# EAGLE design os22_diy (EAGLE 7.1.0)
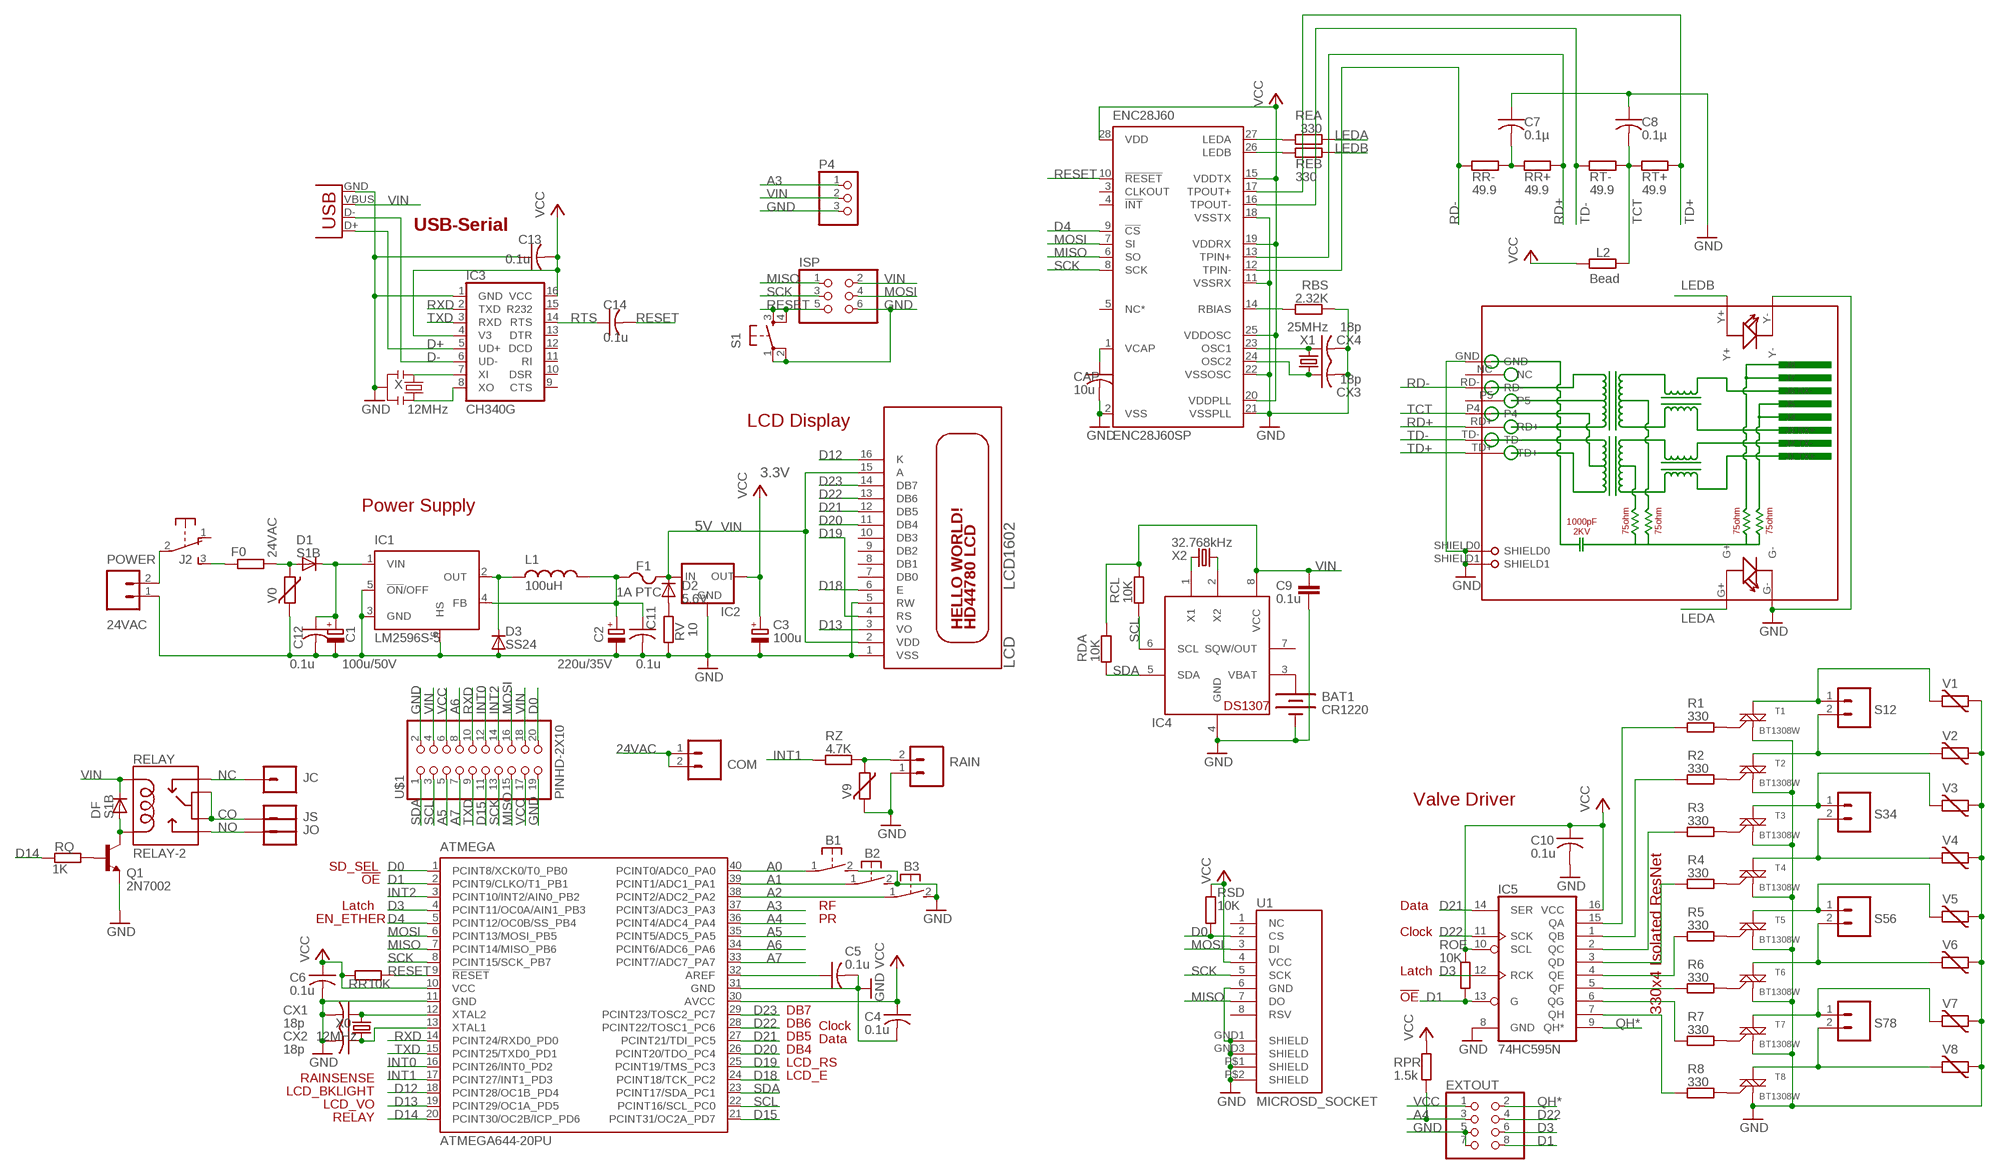
[diagram p0: schematic, sheet 1]

## Parts
ATMEGA  ATMEGA644-20PU  [DIL40]
B1  31-XX  [B3F-31XX]
B2  31-XX  [B3F-31XX]
B3  31-XX  [B3F-31XX]
BAT1  CR1220  BATTERYBATTERY_12MM_SMT  [BATTCON_12MM_SMT]
C1  100u/50V  CPOL-EUE3.5-8  [E3,5-8]
C2  220u/35V  CPOL-EUE3.5-8  [E3,5-8]
C3  100u  CPOL-EUE2-5  [E2-5]
C4  0.1u  C-USC0805K  [C0805K]
C5  0.1u  C-USC0805K  [C0805K]
C6  0.1u  C-USC0805K  [C0805K]
C7  0.1µ  C-USC0805K  [C0805K]
C8  0.1µ  C-USC0805K  [C0805K]
C9  0.1u  C-EUC0805  [C0805]
C10  0.1u  C-USC0805K  [C0805K]
C11  0.1u  C-USC0805K  [C0805K]
C12  0.1u  C-USC0805K  [C0805K]
C13  0.1u  C-USC0805K  [C0805K]
C14  0.1u  C-USC0805K  [C0805K]
CAP  10u  C-USC0805K  [C0805K]
COM  M025MM-X  [SCREWTERMINAL-5MM-2-X]
CX1  18p  C-USC0805K  [C0805K]
CX2  18p  C-USC0805K  [C0805K]
CX3  18p  C-USC0805K  [C0805K]
CX4  18p  C-USC0805K  [C0805K]
D1  S1B  DIODE-DO-214AC  [DO-214AC]
D2  5.6V  DIODE-MINIMELF  [MINIMELF]
D3  SS24  DIODE-SMB  [SMB]
DF  S1B  DIODE-DO-214AC  [DO-214AC]
ENC28J60  ENC28J60SP  [DIL28-3]
EXTOUT  PINHD-2X4  [2X04]
F0  R-EU_0411/3V  [0411V]
F1  1A PTC  PTCFUSE-1812  [1812]
IC1  LM2596S-5  LM2596S  [TO263-5]
IC2  MCP1700SOT233  [SOT23]
IC3  CH340G  [SO16]
IC4  DS1307  DS1307SOIC  [SO08]
IC5  74HC595N  74LS595D  [SO16]
ISP  PINHD-2X3  [2X03]
J2  EG1206  [EG1206]
JC  M01PTH  [1X01]
JO  M01PTH  [1X01]
JS  M01PTH  [1X01]
L1  100uH  INDUCTORPWR  [CDRH125]
L2  Bead  R-EU_R0805  [R0805]
LCD  LCD1602  HD44780LCDNOHOLE  [LCD1602A]
P4  PINHD-1X3  [1X03]
POWER  24VAC  M024MM-X  [SCREWTERMINAL-4MM-2-X]
Q1  2N7002  TRANSISTOR_NPNSOT23-3  [SOT23-3]
R1  330  R-EU_R0805  [R0805]
R2  330  R-EU_R0805  [R0805]
R3  330  R-EU_R0805  [R0805]
R4  330  R-EU_R0805  [R0805]
R5  330  R-EU_R0805  [R0805]
R6  330  R-EU_R0805  [R0805]
R7  330  R-EU_R0805  [R0805]
R8  330  R-EU_R0805  [R0805]
RAIN  M025MM-X  [SCREWTERMINAL-5MM-2-X]
RBS  2.32K  R-EU_R0805  [R0805]
RCL  10K  R-EU_R0805  [R0805]
RDA  10K  R-EU_R0805  [R0805]
REA  330  R-EU_R0805  [R0805]
REB  330  R-EU_R0805  [R0805]
RELAY  RELAY-2  [RELAY-HK4100F]
RJ45  HR911105A  [HR911105A]
ROE  10K  R-EU_R0805  [R0805]
RPR  1.5k  R-EU_R0805  [R0805]
RQ  1K  R-EU_R0805  [R0805]
RR  10K  R-EU_R0805  [R0805]
RR+  49.9  R-EU_R0805  [R0805]
RR-  49.9  R-EU_R0805  [R0805]
RSD  10K  R-EU_R0805  [R0805]
RT+  49.9  R-EU_R0805  [R0805]
RT-  49.9  R-EU_R0805  [R0805]
RV  10  R-EU_R0805  [R0805]
RZ  4.7K  R-EU_R0805  [R0805]
S1  TAC_SWITCHSMD  [TACTILE_SWITCH_SMD]
S12  M025MM-X  [SCREWTERMINAL-5MM-2-X]
S34  M025MM-X  [SCREWTERMINAL-5MM-2-X]
S56  M025MM-X  [SCREWTERMINAL-5MM-2-X]
S78  M025MM-X  [SCREWTERMINAL-5MM-2-X]
T1  BT1308W  MAC97  [TO-92]
T2  BT1308W  MAC97  [TO-92]
T3  BT1308W  MAC97  [TO-92]
T4  BT1308W  MAC97  [TO-92]
T5  BT1308W  MAC97  [TO-92]
T6  BT1308W  MAC97  [TO-92]
T7  BT1308W  MAC97  [TO-92]
T8  BT1308W  MAC97  [TO-92]
U1  MICROSD_SOCKET  USD-SOCKETMICRO-SD-SOCKET-TAOBAO  [MICRO-SD-SOCKET-TAOBAO]
U$1  PINHD-2X10  [2X10-CLEANBIG]
USB  USBPTH  [USB-B-PTH]
V0  MOV  VARISTOR-5  [R-5]
V1  MOV  VARISTOR-5  [R-5]
V2  MOV  VARISTOR-5  [R-5]
V3  MOV  VARISTOR-5  [R-5]
V4  MOV  VARISTOR-5  [R-5]
V5  MOV  VARISTOR-5  [R-5]
V6  MOV  VARISTOR-5  [R-5]
V7  MOV  VARISTOR-5  [R-5]
V8  MOV  VARISTOR-5  [R-5]
V9  MOV  VARISTOR-5  [R-5]
X  12MHz  RESONATORSMD  [RESONATOR-SMD]
X0  12MHz  CRYSTALHC49UV  [HC49U-V]
X1  25MHz  CRYSTALHC49UV  [HC49U-V]
X2  32.768kHz  CRYSTALTC38H  [TC38H]

## Nets
24VAC [power]: COM.1 COM.2 D1.A F0.2 V0.1
A0: ATMEGA.40(PCINT0/ADC0_PA0) B1.1(P)
A1: ATMEGA.39(PCINT1/ADC1_PA1) B2.1(P)
A2: ATMEGA.38(PCINT2/ADC2_PA2) B3.1(P)
A3: ATMEGA.37(PCINT3/ADC3_PA3) P4.1
A4: ATMEGA.36(PCINT4/ADC4_PA4) EXTOUT.3 RPR.1
A5: ATMEGA.35(PCINT5/ADC5_PA5) U$1.5
A6: ATMEGA.34(PCINT6/ADC6_PA6) U$1.8
A7: ATMEGA.33(PCINT7/ADC7_PA7) U$1.7
AREF: ATMEGA.32(AREF) C5.1
CO [relaypower]: JS.1 RELAY.5 RELAY.6
D0: ATMEGA.1(PCINT8/XCK0/T0_PB0) RSD.1 U1.2(CS) U$1.20
D1: ATMEGA.2(PCINT9/CLKO/T1_PB1) EXTOUT.8 IC5.13(G) ROE.1
D3: ATMEGA.4(PCINT11/OC0A/AIN1_PB3) EXTOUT.6 IC5.12(RCK)
D4: ATMEGA.5(PCINT12/OC0B/SS_PB4) ENC28J60.9(!CS)
D12: ATMEGA.18(PCINT28/OC1B_PD4) LCD.16(K)
D13: ATMEGA.19(PCINT29/OC1A_PD5) LCD.3(VO)
D14: ATMEGA.20(PCINT30/OC2B/ICP_PD6) RQ.2
D15: ATMEGA.21(PCINT31/OC2A_PD7) U$1.11
D18: ATMEGA.24(PCINT18/TCK_PC2) LCD.6(E)
D19: ATMEGA.25(PCINT19/TMS_PC3) LCD.4(RS)
D20: ATMEGA.26(PCINT20/TDO_PC4) LCD.11(DB4)
D21: ATMEGA.27(PCINT21/TDI_PC5) IC5.14(SER) LCD.12(DB5)
D22: ATMEGA.28(PCINT22/TOSC1_PC6) EXTOUT.4 IC5.11(SCK) LCD.13(DB6)
D23: ATMEGA.29(PCINT23/TOSC2_PC7) LCD.14(DB7)
D+: IC3.5(UD+) USB.D+
D-: IC3.6(UD-) USB.D-
GND [power]: ATMEGA.11(GND) ATMEGA.31(GND) B1.2(S) B2.2(S) B3.2(S) BAT1.P$1(-) C1.- C2.- C3.- C4.2 C5.2 C6.2 C7.1 C8.1 C9.2 C10.2 C11.2 C12.2 C13.1 CAP.2 CX1.2 CX2.2 CX3.2 CX4.2 D3.A ENC28J60.2(VSS) ENC28J60.11(VSSRX) ENC28J60.18(VSSTX) ENC28J60.21(VSSPLL) ENC28J60.22(VSSOSC) EXTOUT.5 EXTOUT.7 IC1.3(GND) IC1.5(!ON!/OFF) IC1.6(HS) IC2.1(GND) IC3.1(GND) IC4.4(GND) IC5.8(GND) ISP.6 LCD.1(VSS) LCD.5(RW) P4.3 POWER.1 Q1.2(E) RAIN.1 RBS.2 RJ45.G- RJ45.GND RJ45.SHIELD0 RJ45.SHIELD1 RJ45.Y- RV.2 S1.1 S1.2 T1.1(M1) T2.1(M1) T3.1(M1) T4.1(M1) T5.1(M1) T6.1(M1) T7.1(M1) T8.1(M1) U1.6(GND) U1.GND1(SHIELD) U1.GND3(SHIELD) U1.P$1(SHIELD) U1.P$2(SHIELD) U$1.2 U$1.19 USB.GND V0.2 V1.1 V2.1 V3.1 V4.1 V5.1 V6.1 V7.1 V8.1 V9.2 X.2
INT0: ATMEGA.16(PCINT26/INT0_PD2) U$1.12
INT1: ATMEGA.17(PCINT27/INT1_PD3) RZ.2
INT2: ATMEGA.3(PCINT10/INT2/AIN0_PB2) U$1.14
LEDA: REA.2 RJ45.G+
LEDB: REB.2 RJ45.Y+
MISO: ATMEGA.7(PCINT14/MISO_PB6) ENC28J60.6(SO) ISP.1 U1.7(DO) U$1.15
MOSI: ATMEGA.6(PCINT13/MOSI_PB5) ENC28J60.7(SI) ISP.4 U1.3(DI) U$1.16
N$1 [power]: C1.+ C12.1 D1.C IC1.1(VIN)
N$2 [power]: C2.+ C11.1 F1.1 IC1.4(FB) L1.2
N$3: R1.1 T1.2(G)
N$4: IC5.5(QF) R6.2
N$5: IC5.6(QG) R7.2
N$6 [power]: J2.2(P) POWER.2
N$7: IC5.7(QH) R8.2
N$8: BAT1.P$2(+) IC4.3(VBAT)
N$9 [power]: D3.C IC1.2(OUT) L1.1
N$10: IC5.4(QE) R5.2
N$11: IC5.3(QD) R4.2
N$12: IC5.2(QC) R3.2
N$13: IC5.1(QB) R2.2
N$14: IC5.15(QA) R1.2
N$15: R2.1 T2.2(G)
N$16 [power]: S12.1 T1.3(M2) V1.2
N$17 [power]: S12.2 T2.3(M2) V2.2
N$18 [power]: S34.1 T3.3(M2) V3.2
N$19: ENC28J60.14(RBIAS) RBS.1
N$20 [power]: S34.2 T4.3(M2) V4.2
N$21: R3.1 T3.2(G)
N$22 [power]: S56.1 T5.3(M2) V5.2
N$23 [power]: S56.2 T6.3(M2) V6.2
N$24 [power]: S78.1 T7.3(M2) V7.2
N$25 [power]: S78.2 T8.3(M2) V8.2
N$26: R4.1 T4.2(G)
N$27: R5.1 T5.2(G)
N$28: R6.1 T6.2(G)
N$29: R7.1 T7.2(G)
N$30: IC4.1(X1) X2.2
N$31: RAIN.2 RZ.1 V9.1
N$32 [power]: F0.1 J2.3(S)
N$33: CAP.1 ENC28J60.1(VCAP)
N$34: ENC28J60.27(LEDA) REA.1
N$35: DF.A Q1.3(C) RELAY.9
N$36: IC4.2(X2) X2.1
N$37: ENC28J60.26(LEDB) REB.1
N$39: D2.A RV.1
N$40: Q1.1(B) RQ.1
N$41: CX3.1 ENC28J60.24(OSC2) X1.2
N$42: CX4.1 ENC28J60.23(OSC1) X1.1
N$43: R8.1 T8.2(G)
N$44: IC3.7(XI) X.1
N$46: ATMEGA.12(XTAL2) CX1.1 X0.2
N$47: ATMEGA.13(XTAL1) CX2.1 X0.1
N$48: IC3.8(XO) X.3
N$54: C7.2 RR+.1 RR-.2
NC [relaypower]: JC.1 RELAY.1
NO [relaypower]: JO.1 RELAY.10
QH*: EXTOUT.2 IC5.9(QH*)
RD+: ENC28J60.13(TPIN+) RJ45.RD+ RR+.2
RD-: ENC28J60.12(TPIN-) RJ45.RD- RR-.1
RESET: ATMEGA.9(!RESET) C14.2 ENC28J60.10(!RESET) ISP.5 RR.2 S1.3 S1.4
RTS: C14.1 IC3.14(RTS)
RXD: ATMEGA.14(PCINT24/RXD0_PD0) IC3.2(TXD) U$1.10
SCK: ATMEGA.8(PCINT15/SCK_PB7) ENC28J60.8(SCK) ISP.3 U1.5(SCK) U$1.13
SCL: ATMEGA.22(PCINT16/SCL_PC0) IC4.6(SCL) RCL.2 U$1.3
SDA: ATMEGA.23(PCINT17/SDA_PC1) IC4.5(SDA) RDA.2 U$1.1
TCT: C8.2 L2.1 RJ45.P4 RT+.1 RT-.2
TD+: ENC28J60.17(TPOUT+) RJ45.TD+ RT+.2
TD-: ENC28J60.16(TPOUT-) RJ45.TD- RT-.1
TXD: ATMEGA.15(PCINT25/TXD0_PD1) IC3.3(RXD) U$1.9
VCC: ATMEGA.10(VCC) ATMEGA.30(AVCC) C3.+ C4.1 C6.1 C10.1 C13.2 ENC28J60.15(VDDTX) ENC28J60.19(VDDRX) ENC28J60.20(VDDPLL) ENC28J60.25(VDDOSC) ENC28J60.28(VDD) EXTOUT.1 IC2.2(OUT) IC3.4(V3) IC3.16(VCC) IC5.10(SCL) IC5.16(VCC) L2.2 ROE.2 RPR.2 RR.1 RSD.2 U1.4(VCC) U$1.6 U$1.17
VIN [power]: C9.1 D2.C DF.C F1.2 IC2.3(IN) IC4.8(VCC) ISP.2 LCD.2(VDD) LCD.15(A) P4.2 RCL.1 RDA.1 RELAY.2 U$1.4 U$1.18 USB.VBUS
Unconnected: ENC28J60.3(CLKOUT) ENC28J60.4(!INT) ENC28J60.5(NC*) IC3.9(CTS) IC3.10(DSR) IC3.11(RI) IC3.12(DCD) IC3.13(DTR) IC3.15(R232) IC4.7(SQW/OUT) J2.1(O) LCD.7(DB0) LCD.8(DB1) LCD.9(DB2) LCD.10(DB3) RJ45.NC RJ45.P5 U1.1(NC) U1.8(RSV)

## Notes on the sheet
- USB-Serial
- LCD Display
- 3.3V
- Power Supply
- 5V
- Valve Driver
- SD_SEL
- !OE
- Latch | RF | Data
- EN_ETHER | PR
- Clock
- Latch
- !OE
- DB7 | 330x4 Isolated ResNet
- Clock
- DB6
- Data
- DB5
- DB4
- LCD_RS
- RAINSENSE
- LCD_E
- LCD_BKLIGHT
- LCD_VO
- RELAY

## Library data of the parts
ATMEGA = atmel:ATMEGA644-*PU: 8-bit Microcontroller with 64K Bytes In-System Programmable Flash Auto generated by make-symbol-device-package-bsdl.ulp Rev. 34 Source: http://www.atmel.com/dyn/resources/prod_documents/doc2593.pdf; MPN: ATMEGA644-20PU; OC_FARNELL: 1288340; OC_NEWARK: 23M5060
B1-B3 = adafruit:31-XX: OMRON SWITCH Now with beefier pads!
BAT1 = SparkFunNew:BATTERY: Battery Holders Various common sizes : AA, AAA, 20mm coin cell and 12mm coin cell.
C1-C3 = resistor:CPOL-EU: POLARIZED CAPACITOR, European symbol
C4-C8 C10-C12 CAP CX1-CX4 = adafruit2013:C-US: CAPACITOR, American symbol
C9 = rcl:C-EU: CAPACITOR, European symbol
C13 C14 = adafruit:C-US: CAPACITOR, American symbol
COM POWER RAIN S12 S34 S56 S78 = SparkFun:M02: Header 2 Standard 2-pin 0.1" header. Use with straight break away headers (SKU : PRT-00116), right angle break away headers (PRT-00553), swiss pins (PRT-00743), machine pins (PRT-00117), and female headers (PRT-00115). Molex polarized connector foot print use with SKU : PRT-08233 with associated crimp pins and housings.
D1-D3 DF = diode:DIODE-: DIODE
ENC28J60 = microchip:ENC28J60: Stand-Alone Ethernet Controller with SPI Interface Source: http://ww1.microchip.com/downloads/en/DeviceDoc/39662c.pdf; MF: MICROCHIP; MPN: ENC28J60/SP; OC_FARNELL: 1084619; OC_NEWARK: 96K3661
EXTOUT = pinhead:PINHD-2X4: PIN HEADER
F0 L2 R1-R8 RBS RCL RDA REA REB ROE RPR RQ RR RR+ RR- RSD RT+ RT- RV RZ = rcl:R-EU_: RESISTOR, European symbol
F1 = adafruit:PTCFUSE: PTC fuses, resettable thermistors
IC1 = national-semiconductor:LM2596: SIMPLE SWITCHER® Power Converter 150 kHz 3A Step-Down Voltage Regulator Source: http://www.national.com/ds/LM/LM2596.pdf; MF: NATIONAL SEMICONDUCTOR; MPN: LM2596S-ADJ/NOPB; OC_FARNELL: 9494367; OC_NEWARK: 41K3842
IC2 = adafruit:MCP1700: VOLTAGE REGULATOR
IC3 = SparkFunNew:CH340
IC4 = adafruit:DS1307: DS1307 Real time clock (RTC) with battery backup ability. Talk to it via i2c
IC5 = SparkFun:74*595: 8-bit SHIFT REGISTER, output latch
ISP = pinhead:PINHD-2X3: PIN HEADER
J2 = adafruit:EG1206
JC JO JS = SparkFun:M01: Header 1 Standard 1-pin 0.1" header. Use with straight break away headers (SKU : PRT-00116), right angle break away headers (PRT-00553), swiss pins (PRT-00743), machine pins (PRT-00117), and female headers (PRT-00115).
L1 = SparkFunNew:INDUCTOR: Inductors Basic Inductor/Choke - 0603 and 1206. Footprints are not proven and vary greatly between part numbers.
LCD = adafruit:HD44780LCD: HD44780 LCD Standard character type LCDs, available in sizes from 8x1 to 40x4!
P4 = pinhead:PINHD-1X3: PIN HEADER
Q1 = SparkFunNew:TRANSISTOR_NPN: Transistor NPN BJT configuration in SOT23 package. MMBT2222 is the common NPN we use. Double check BCE configuration again layout.
RELAY = SparkFunNew:RELAY-2
RJ45 = CONNECTER:HR911105A
S1 = SparkFunNew:TAC_SWITCH: Momentary Switch Button commonly used for reset or general input. Spark Fun Electronics SKU : COM-00097
T1-T8 = SparkFun:MAC97: MAC97 Triac http://www.onsemi.com/pub_link/Collateral/MAC97-D.PDF
U1 = SparkFunNew:USD-SOCKET: microSD Socket Push-push type uSD socket. Schematic element and footprint production proven. Spark Fun Electronics SKU : PRT-00127. tDoc lines correctly indicate media card edge positions when inserting (unlocked, locked, depressed).
U$1 = adafruit:PINHD-2X10
USB = SparkFunNew:USB: USB Connectors USB-B-PTH is fully proven SKU : PRT-00139 USB-miniB is fully proven SKU : PRT-00587 USB-A-PCB is untested. USB-A-H is throughly reviewed, but untested. Spark Fun Electronics SKU : PRT-00437 USB-B-SMT is throughly reviewed, but untested. Needs silkscreen touching up. USB-A-S has not been used/tested USB-MB-H has not been used/tested
V0 V1-V9 = varistor:VARISTOR: VARISTOR
X = SparkFunNew:RESONATOR: Resonator Small SMD resonator. This is the itty bitty 10/20MHz resonators with built in caps. CSTCE10M0G55 and CSTCE20M0V53. Footprint has been reviewed closely but hasn't been tested yet.
X0 X1 = SparkFun:CRYSTAL: Crystals Various standard crystals. Proven footprints. Spark Fun Electronics SKU : COM-00534
X2 = crystal:CRYSTAL: CRYSTAL; OC_FARNELL: unknown; OC_NEWARK: unknown

## Net classes
0 default: width 0.203 mm, clearance 0.203 mm
1 power: width 0.305 mm, clearance 0.203 mm
2 relaypower: width 0.508 mm, clearance 0.305 mm

## Board
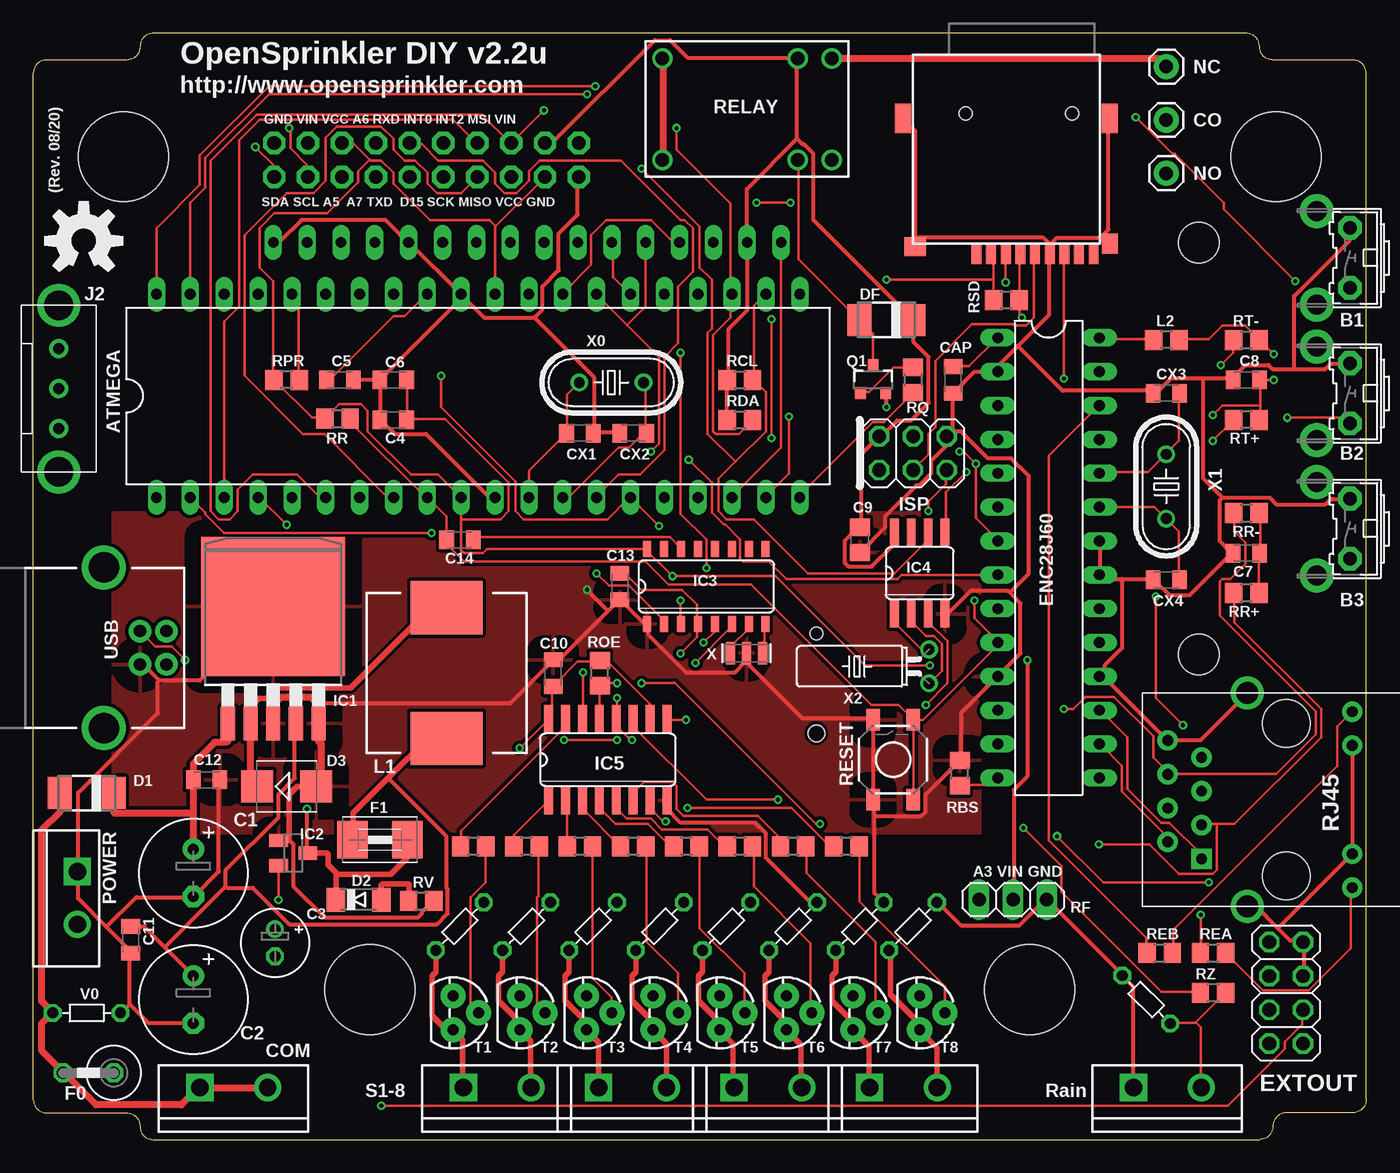
[diagram p1: board, top side]
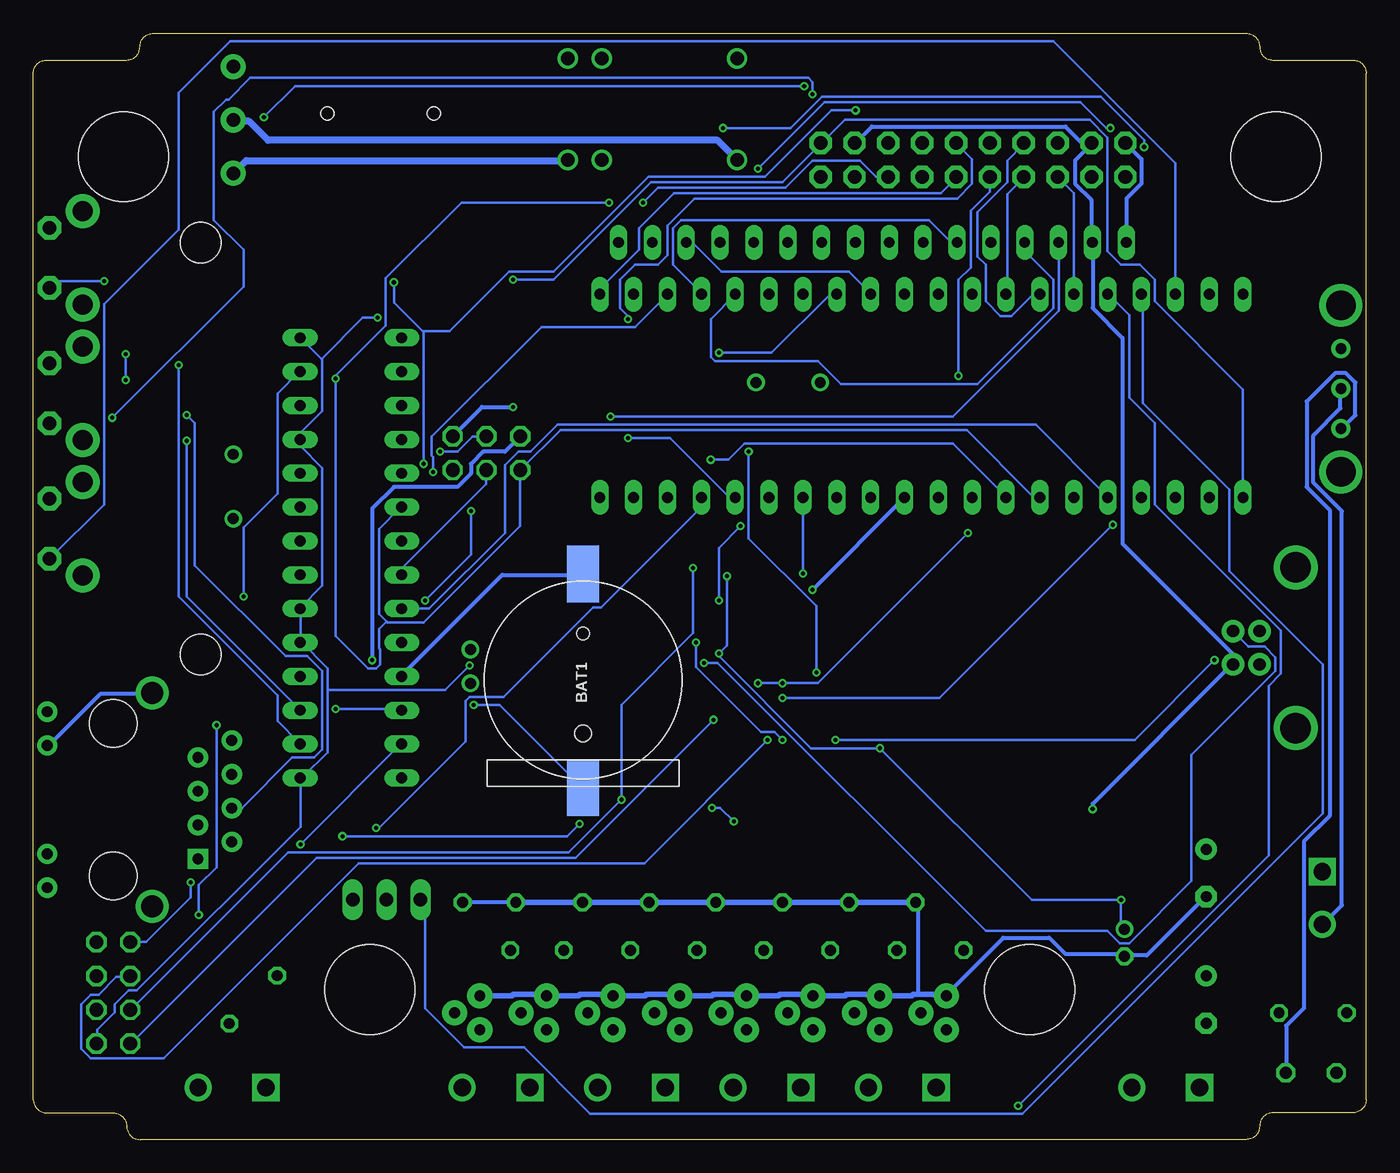
[diagram p2: board, bottom side, seen from below]

Size 100 x 83 mm. Coordinates in mm from the lower left corner, seen from the top.
Outline: 90,83 9,83 arc90 8,82 arc-90 7,81 1,81 arc90 0,80 0,3 arc90 1,2 7,2 arc-90 8,1 arc90 9,0 92,0 arc90 93,1 arc-90 94,2 99,2 arc90 100,3 100,80 arc90 99,81 93,81 arc-90 92,82 arc90 91,83 90,83
Copper layers (1*16): Top 0.035mm / dielectric 1.5mm / Bottom 0.035mm
Design rules "Fusion_eagle_rule_v1.1 *": minimum track width 6mil, minimum drill 12mil, track to track 6mil, track to pad 6mil, pad to pad 6mil, via to via 6mil, smd to smd 0mil, copper to edge 10mil, drill to drill 10mil, minimum pad ring 10mil, minimum via ring 6mil, stop-mask expansion 2mil, vias tented up to drill 100mil, thermal gap 50mil
Holes 3.05 mm at 87.46,67.3 87.46,36.38
Holes 6.75 mm at 6.76,73.74 93.24,73.74 25.26,11.26 74.74,11.26
tRestrict: area 84.4,31.3 to 90.5,37.4; area 84.4,62.2 to 90.5,68.3; area 2.8,67.7 to 10.8,75.7; area 89.2,67.7 to 97.2,75.7; area 21.3,5.3 to 29.3,13.3; area 70.7,5.3 to 78.7,13.3
bRestrict: area 2.8,67.7 to 10.8,75.7; area 89.2,67.7 to 97.2,75.7; area 21.3,5.3 to 29.3,13.3; area 70.7,5.3 to 78.7,13.3; area 84.4,62.2 to 90.5,68.3; area 84.4,31.3 to 90.5,37.4
vRestrict: area 70,19.5 to 77,20.5; area 17.3,76.2 to 39.3,76.9; area 17.1,70 to 42.6,70.7

### Footprints (pad centres in the part's own frame; a part is rotated, then mirrored left to right if it is on the bottom)
DIL40 = drill 0.813 long: 1 -24.13,-7.62; 2 -21.59,-7.62; 3 -19.05,-7.62; 4 -16.51,-7.62; 5 -13.97,-7.62; 6 -11.43,-7.62; 7 -8.89,-7.62; 8 -6.35,-7.62; 9 -3.81,-7.62; 10 -1.27,-7.62; 11 1.27,-7.62; 12 3.81,-7.62; 13 6.35,-7.62; 14 8.89,-7.62; 15 11.43,-7.62; 16 13.97,-7.62; 17 16.51,-7.62; 18 19.05,-7.62; 19 21.59,-7.62; 20 24.13,-7.62; 21 24.13,7.62; 22 21.59,7.62; 23 19.05,7.62; 24 16.51,7.62; 25 13.97,7.62; 26 11.43,7.62; 27 8.89,7.62; 28 6.35,7.62; 29 3.81,7.62; 30 1.27,7.62; 31 -1.27,7.62; 32 -3.81,7.62; 33 -6.35,7.62; 34 -8.89,7.62; 35 -11.43,7.62; 36 -13.97,7.62; 37 -16.51,7.62; 38 -19.05,7.62; 39 -21.59,7.62; 40 -24.13,7.62
B3F-31XX = drill 1.016 pad 1.778 octagon: 1 -2.261,-1.245; 2 2.261,-1.245 | drill 1.499 pad 2.54: 3 -3.505,1.245; 4 3.505,1.245
BATTCON_12MM_SMT = smd 2.4 x 4.3: P$1 0,11.96 | smd 2.4 x 4.2: P$2 0,-4.1 | hole 0.95: 0,7.5 | hole 1.25: 0,0
E3,5-8 = drill 0.813 pad 1.6: + -1.778,0 | drill 0.813 pad 1.6 octagon: - 1.778,0
E2-5 = drill 0.813 pad 1.27: + -1.016,0 | drill 0.813 pad 1.27 octagon: - 1.016,0
C0805K = smd 1.1 x 1.4: 1 -1,0; 2 1,0
C0805 = smd 1.3 x 1.5: 1 -0.95,0; 2 0.95,0
SCREWTERMINAL-5MM-2-X = drill 1.3 pad 2.032 square: 1 0,0 | drill 1.3 pad 2.032: 2 5.08,0
DO-214AC = smd 1.8 x 2.4: A 2.025,0; C -2.025,0
MINIMELF = smd 1.4 x 1.8: A 1.7,0; C -1.7,0
SMB = smd 2.4 x 2.4: A 2.2,0; C -2.2,0
DIL28-3 = drill 0.813 long: 1 -16.51,-3.81; 2 -13.97,-3.81; 3 -11.43,-3.81; 4 -8.89,-3.81; 5 -6.35,-3.81; 6 -3.81,-3.81; 7 -1.27,-3.81; 8 1.27,-3.81; 9 3.81,-3.81; 10 6.35,-3.81; 11 8.89,-3.81; 12 11.43,-3.81; 13 13.97,-3.81; 14 16.51,-3.81; 15 16.51,3.81; 16 13.97,3.81; 17 11.43,3.81; 18 8.89,3.81; 19 6.35,3.81; 20 3.81,3.81; 21 1.27,3.81; 22 -1.27,3.81; 23 -3.81,3.81; 24 -6.35,3.81; 25 -8.89,3.81; 26 -11.43,3.81; 27 -13.97,3.81; 28 -16.51,3.81
2X04 = drill 1.016 octagon: 1 -3.81,-1.27; 2 -3.81,1.27; 3 -1.27,-1.27; 4 -1.27,1.27; 5 1.27,-1.27; 6 1.27,1.27; 7 3.81,-1.27; 8 3.81,1.27
0411V = drill 0.914 octagon: 1 -2.54,0; 2 1.27,0
1812 = smd 2.286 x 2.794: 1 -2.046,0; 2 2.046,0
TO263-5 = smd 1.067 x 2.54: 1 -3.404,-5.791; 2 -1.702,-5.791; 3 0,-5.791; 4 1.702,-5.791; 5 3.404,-5.791 | smd 10.8 x 10.41: 6 0,3
SOT23 = smd 1 x 1.4: 1 -0.95,-1.1; 2 0.95,-1.1; 3 0,1.1
SO16 = smd 0.6 x 1.2: 1 -4.445,-2.8; 2 -3.175,-2.8; 3 -1.905,-2.8; 4 -0.635,-2.8; 5 0.635,-2.8; 6 1.905,-2.8; 7 3.175,-2.8; 8 4.445,-2.8; 9 4.445,2.8; 10 3.175,2.8; 11 1.905,2.8; 12 0.635,2.8; 13 -0.635,2.8; 14 -1.905,2.8; 15 -3.175,2.8; 16 -4.445,2.8
SO08 = smd 0.66 x 2.032: 1 -1.905,-3.073; 2 -0.635,-3.073; 3 0.635,-3.073; 4 1.905,-3.073; 5 1.905,3.073; 6 0.635,3.073; 7 -0.635,3.073; 8 -1.905,3.073
SO16' = smd 0.66 x 2.032: 1 -4.445,-3.073; 2 -3.175,-3.073; 3 -1.905,-3.073; 4 -0.635,-3.073; 5 0.635,-3.073; 6 1.905,-3.073; 7 3.175,-3.073; 8 4.445,-3.073; 9 4.445,3.073; 10 3.175,3.073; 11 1.905,3.073; 12 0.635,3.073; 13 -0.635,3.073; 14 -1.905,3.073; 15 -3.175,3.073; 16 -4.445,3.073
2X03 = drill 1.016 octagon: 1 -2.54,-1.27; 2 -2.54,1.27; 3 0,-1.27; 4 0,1.27; 5 2.54,-1.27; 6 2.54,1.27
EG1206 = drill 0.8 pad 1.422: 1 -3,0; 2 0,0; 3 3,0 | drill 2.2: MT1 -6.25,0; MT2 6.25,0
1X01 = drill 1.016 pad 1.88: 1 0,0
CDRH125 = smd 5.4 x 4: 1 0,4.9; 2 0,-4.9
R0805 = smd 1.3 x 1.5: 1 -0.95,0; 2 0.95,0
LCD1602A = drill 0.8 long: 1 8,33.46; 2 10.54,33.46; 3 13.08,33.46; 4 15.62,33.46; 5 18.16,33.46; 6 20.7,33.46; 7 23.24,33.46; 8 25.78,33.46; 9 28.32,33.46; 10 30.86,33.46; 11 33.4,33.46; 12 35.94,33.46; 13 38.48,33.46; 14 41.02,33.46; 15 43.56,33.46; 16 46.1,33.46
1X03 = drill 1.016 long: 1 -2.54,0; 2 0,0; 3 2.54,0
SCREWTERMINAL-4MM-2-X = drill 1.3 pad 2.032 square: 1 0,0 | drill 1.3 pad 2.032: 2 3.96,0
SOT23-3 = smd 0.8 x 0.9: 1 -0.95,-1; 2 0.95,-1; 3 0,1.1
RELAY-HK4100F = drill 1.016: 1 12.7,7.62; 2 10.16,7.62; 5 0,7.62; 6 0,0; 9 10.16,0; 10 12.7,0
HR911105A = drill 0.813 pad 1.524: G+ 4.953,-6.604; G- 4.953,-4.064; GND -8.89,4.445; NC -6.35,3.175; P4 -8.89,-0.635; P5 -6.35,0.635; RD+ -6.35,-1.905; RD- -8.89,1.905; TD- -8.89,-3.175; Y+ 4.953,6.604; Y- 4.953,4.064 | drill 1.651 pad 2.159: SHIELD0 -2.921,8.001; SHIELD1 -2.921,-8.001 | drill 0.813 pad 1.524 square: TD+ -6.35,-4.445 | hole 3.556: 0,-5.715; 0,5.715
TACTILE_SWITCH_SMD = smd 1.6 x 1: 1 -3,1.5; 2 3,1.5; 3 -3,-1.5; 4 3,-1.5
TO-92 = drill 0.813 pad 1.88: 1 -1.27,0; 2 0,1.905; 3 1.27,0
MICRO-SD-SOCKET-TAOBAO = smd 0.75 x 1.6: 1 2.25,10.5; 2 1.15,10.5; 3 0.05,10.5; 4 -1.05,10.5; 5 -2.15,10.5; 6 -3.25,10.5; 7 -4.35,10.5; 8 -5.45,10.5 | smd 0.7 x 1.6: CD -6.55,10.5 | smd 1.2 x 1.5: GND1 -7.75,9.8 | smd 1.6 x 1.4: GND3 6.85,10 | smd 1.2 x 2.2: P$1 7.75,0.4; P$2 -7.75,0.4 | hole 1: 3.05,0; -4.93,0
2X10-CLEANBIG = drill 1.016 pad 1.676 octagon: 1 -11.43,-1.27; 2 -11.43,1.27; 3 -8.89,-1.27; 4 -8.89,1.27; 5 -6.35,-1.27; 6 -6.35,1.27; 7 -3.81,-1.27; 8 -3.81,1.27; 9 -1.27,-1.27; 10 -1.27,1.27; 11 1.27,-1.27; 12 1.27,1.27; 13 3.81,-1.27; 14 3.81,1.27; 15 6.35,-1.27; 16 6.35,1.27; 17 8.89,-1.27; 18 8.89,1.27; 19 11.43,-1.27; 20 11.43,1.27
USB-B-PTH = drill 0.914 pad 1.676: D+ 0,1.25; D- 1.981,1.25; GND 0,-1.25; VBUS 1.981,-1.25 | drill 2.286: S1 -2.718,-6.02; S2 -2.718,6.02
R-5 = drill 0.813 octagon: 1 -2.54,0; 2 2.54,0
RESONATOR-SMD = smd 0.7 x 1.7: 1 -1.2,0; 2 0,0; 3 1.2,0
HC49U-V = drill 0.813: 1 -2.413,0; 2 2.413,0
TC38H = drill 0.813: 1 -1.27,0; 2 1.27,0

### Placement (x,y rotation side)
ATMEGA  33.37,55.8 0 top
B1  97.54,66.15 90 top
B2  97.54,55.99 90 top
B3  97.54,45.83 90 top
BAT1  58.75,30.48 0 bottom
C1  12,20 270 top
C2  12,10.5 270 top
C3  18.14,14.76 270 top
C4  27,54 180 top
C5  23,57 0 top
C6  27,57 180 top
C7  91,44 0 top
C8  91,57 0 top
C9  62,45 270 top
C10  39,35 90 top
C11  7.3,15 270 top
C12  13,27 0 top
C13  44,41.5 90 top
C14  32,45 180 top
CAP  69,57 270 top
COM  12.5,3.9 0 top
CX1  41,53 0 top
CX2  45,53 180 top
CX3  85,56 180 top
CX4  85,42 180 top
D1  4,26 180 top
D2  24.4,18 0 top
D3  19,26.5 0 top
DF  64,61.5 180 top
ENC28J60  76.17,43.64 270 top
EXTOUT  94,11 90 top
F0  3.5,5 180 top
F1  26,22.5 0 top
IC1  18,37 0 top
IC2  19.5,21.5 270 top
IC3  50.5,41.5 0 top
IC4  66.5,42.5 0 top
IC5  74HC595N  [SO16']  43.1,28.5 0 top
ISP  66,51.5 0 top
J2  1.9,56.34 270 top
JC  85,80.5 0 top
JO  85,72.5 0 top
JS  85,76.5 0 top
L1  31,35 0 top
L2  85,60 180 top
LCD  10,33.84 0 top
P4  73.5,18 0 top
POWER  3.3,20.1 270 top
Q1  63,57 0 top
R1  33,22 180 top
R2  37,22 180 top
R3  41,22 180 top
R4  45,22 180 top
R5  49,22 180 top
R6  53,22 180 top
R7  57,22 180 top
R8  61,22 180 top
RAIN  82.55,3.9 0 top
RBS  69.5,27.5 90 top
RCL  53,57 0 top
RDA  53,54 0 top
REA  88.5,14 0 top
REB  84.5,14 0 top
RELAY  47.2,73.5 0 top
RJ45  94,25.5 0 top
ROE  42.5,35 90 top
RPR  19,57 180 top
RQ  66,57 270 top
RR  22.82,54.08 0 top
RR+  91,41 180 top
RR-  91,47 0 top
RSD  73,63 0 top
RT+  91,54 180 top
RT-  91,60 0 top
RV  29.1,17.9 0 top
RZ  88.5,11 180 top
S1  64.5,28.5 90 top
S12  32.26,3.9 0 top
S34  42.42,3.9 0 top
S56  52.58,3.9 0 top
S78  62.74,3.9 0 top
T1  31.5,9.5 270 top
T2  36.5,9.5 270 top
T3  41.5,9.5 270 top
T4  46.5,9.5 270 top
T5  51.5,9.5 270 top
T6  56.5,9.5 270 top
T7  61.5,9.5 270 top
T8  66.5,9.5 270 top
U1  73,77 180 top
U$1  29.5,73.5 0 top
USB  8,36.9 0 top
V0  4,9.5 0 top
V1  32,16 225 top
V2  37,16 225 top
V3  42,16 225 top
V4  47,16 225 top
V5  52,16 225 top
V6  57,16 225 top
V7  62,16 225 top
V8  66,16 225 top
V9  83.5,10.5 135 top
X  53.5,36.5 0 top
X0  43.37,56.8 180 top
X1  85,49 90 top
X2  67.2,35.5 90 top

### Tracks (layer width: path | path; a pad name or v marks a point on that pad's centre or on a via)
24VAC
  Top 0.508: COM.2 COM.1 12.3,3.8 11.1,2.6 4.7,2.6 2.3,5 F0.2 2.1,5.2 0.6,6.7 0.6,8.7 1.4,9.5 V0.1 1.3,9.7 0.6,10.4 0.6,23.2 2,24.6 2,26 D1.A
A0  (via drill 0.3)
  Top 0.203: v42.16,79.05 17.68,79.05 12.5,73.86 12.5,71.63 9.25,68.38 9.25,63.5 ATMEGA.40 | v82.7,76.71 85.45,73.97 85.65,73.97 89.31,70.31 89.31,69.8 v94.69,64.41
  Bottom 0.203: v42.16,79.05 80.37,79.05 v82.7,76.71 | v94.69,64.41 98.25,64.41 98.75,63.91 B1.1
A1  (via drill 0.3)
  Top 0.203: v41.55,78.44 17.68,78.44 12.9,73.66 12.9,71.42 11.79,70.31 11.79,63.5 ATMEGA.39 | v94.08,54.15 98.35,54.15 98.75,53.75 B2.1
  Bottom 0.203: v41.55,78.44 41.55,79.35 41.86,79.65 83.72,79.65 85.34,78.03 85.55,78.03 86.46,77.11 86.46,68.99 84.23,66.75 84.23,64.01 v94.08,54.15
A2
  Bottom 0.203: ATMEGA.38 14.33,63.5 14.33,73.25 23.47,82.4 85.24,82.4 89.1,78.54 89.1,68.28 94.69,62.69 94.69,47.65 98.75,43.59 B3.1
A3
  Bottom 0.203: ATMEGA.37 16.76,63.4 16.76,55.27 10.26,48.77 10.26,42.67 3.25,35.66 3.25,24.49 25.81,1.93 58.22,1.93 63.2,6.91 67.67,6.91 70.61,9.86 70.61,17.68 70.92,17.98 P4.1
A4  (via drill 0.3)
  Top 0.203: RPR.1 19.91,57.1 19.91,62.89 19.41,63.4 ATMEGA.36 | v26.11,2.54 89.61,2.54 93.88,6.81 93.88,7.32 95.2,8.64 95.2,9.65 EXTOUT.3
  Bottom 0.203: v26.11,2.54 7.32,21.34 7.32,34.04 6.4,34.95 6.4,38.2 15.85,47.65 15.85,53.75 17.78,55.68 17.78,61.87 19.3,63.4 ATMEGA.36
A5
  Bottom 0.203: ATMEGA.35 21.95,63.5 21.95,71.02 23.06,72.14 U$1.5
A6
  Bottom 0.203: ATMEGA.34 24.49,63.4 24.99,63.4 26.62,61.77 27.43,61.77 28.55,62.89 28.55,65.63 29.16,66.24 29.16,69.6 26.92,71.83 26.92,73.46 25.7,74.68 U$1.8
A7
  Bottom 0.203: ATMEGA.33 26.92,63.5 26.92,70.92 25.7,72.14 U$1.7
AREF
  Top 0.203: C5.1 22.05,57.1 22.35,57.1 27.03,61.77 27.84,61.77 29.46,63.4 ATMEGA.32
CO
  Top 0.508: RELAY.6 47.24,73.56 47.24,81.08 RELAY.5
  Bottom 0.508: JS.1 84.94,76.4 83.82,76.4 82.4,74.98 48.67,74.98 47.24,73.56 RELAY.6
D0  (via drill 0.3)
  Top 0.203: 72.03,64.52 72.03,66.34 71.93,66.45 U1.2 | 72.03,64.52 72.03,63.09 RSD.1 | v64.01,64.52 72.03,64.52
  Bottom 0.203: ATMEGA.1 9.25,48.26 9.25,56.29 15.85,62.89 15.85,64.52 16.97,65.63 18.39,65.63 19.41,66.65 19.41,75.18 20.73,76.5 39.12,76.5 40.84,74.78 U$1.20 40.95,74.68 43.79,71.83 53.65,71.83 60.96,64.52 v64.01,64.52
D1  (via drill 0.3)
  Top 0.203: IC5.13 42.47,31.6 42.47,34.04 ROE.1 42.57,34.14 42.67,34.24 v43.79,34.24 | v29.87,45.52 14.33,45.52 12.9,46.94 12.9,47.04 11.79,48.16 ATMEGA.2 | v88.19,19.3 80.26,19.3 v76.81,22.76 | v59.03,23.67 58.73,23.67 48.16,34.24 v45.62,34.24
  Bottom 0.203: v29.87,45.52 41.15,34.24 v43.79,34.24 v45.62,34.24 | v88.19,19.3 88.19,18.19 91.54,14.83 92.66,14.83 EXTOUT.8 | v76.81,22.76 59.94,22.76 v59.03,23.67
D3  (via drill 0.3)
  Top 0.203: v43.79,33.12 43.79,31.6 IC5.12 43.79,31.5 43.79,30.99 44.6,30.18 44.7,30.18 v44.91,29.97 | v19,46.13 16.87,48.26 ATMEGA.4
  Bottom 0.203: v43.79,33.12 32,33.12 v19,46.13 | v44.91,29.97 54.15,20.73 75.59,20.73 90.22,6.1 95.71,6.1 96.42,6.81 96.42,10.16 95.71,10.87 95.1,10.87 93.78,12.19 92.76,12.19 EXTOUT.6
D4
  Bottom 0.203: ENC28J60.9 72.34,39.83 70.31,39.83 64.62,45.52 64.62,50.6 63.6,51.61 62.69,51.61 60.66,53.65 24.79,53.65 19.41,48.26 ATMEGA.5
D12
  Top 0.203: LCD.16 56.08,67.26 56.08,51.92 52.43,48.26 ATMEGA.18
D13  (via drill 0.3)
  Top 0.203: v56.69,54.25 56.69,49.99 54.97,48.26 ATMEGA.19
  Bottom 0.203: v56.69,54.25 30.99,54.25 23.06,62.18 23.06,67.26 LCD.3
D14
  Top 0.203: RQ.2 65.94,55.98 63.8,53.85 62.99,53.85 57.4,48.26 ATMEGA.20
D15
  Bottom 0.203: ATMEGA.21 57.4,63.5 57.4,63.91 54.56,66.75 54.56,68.38 51.92,71.02 31.9,71.02 30.79,72.14 U$1.11
D18
  Bottom 0.203: LCD.6 30.79,67.36 31.19,67.36 32.82,68.99 51.41,68.99 52.02,68.38 52.02,65.63 49.89,63.5 ATMEGA.24
D19
  Bottom 0.203: LCD.4 25.6,67.26 25.6,66.65 23.47,64.52 23.47,62.38 29.16,56.69 39.42,56.69 41.15,58.42 48.87,58.42 49.17,58.73 49.17,61.57 47.35,63.4 ATMEGA.25
D20
  Top 0.203: LCD.11 43.48,67.26 43.48,64.72 44.7,63.5 ATMEGA.26
D21  (via drill 0.3)
  Top 0.203: v41.25,35.05 41.25,31.6 IC5.14 | v46.33,51.61 46.94,52.22 46.94,58.73 44.55,61.11 | 44.55,61.11 42.27,63.4 ATMEGA.27 | 44.55,61.11 45.92,62.48 45.92,67.26 LCD.12
  Bottom 0.203: v41.25,35.05 41.25,40.03 46.33,45.11 v46.33,51.61
D22  (via drill 0.3)
  Top 0.203: LCD.13 48.46,67.36 47.95,67.36 46.33,68.99 42.98,68.99 41.86,67.87 41.86,65.63 39.73,63.5 ATMEGA.28 | v55.88,25.5 50.49,25.5 45.01,30.99 45.01,31.5 IC5.11 | v48.56,59.03 48.56,46.94 50.49,45.01 v50.49,42.88
  Bottom 0.203: EXTOUT.4 92.66,9.75 80.87,21.54 59.84,21.54 v55.88,25.5 55.88,32.61 50.49,38 v50.49,42.88 | v48.56,59.03 44.6,59.03 40.23,63.4 39.73,63.4 ATMEGA.28
D23
  Bottom 0.203: LCD.14 51,67.26 50.49,67.26 48.36,65.13 38.81,65.13 37.19,63.5 ATMEGA.29
D+  (via drill 0.3)
  Top 0.203: v50.29,37.29 51.1,38.1 51.1,38.61 IC3.5 | v39.83,29.97 v43.79,29.97 | v11.38,35.97 10.36,36.98 9.14,36.98 8.03,38.1 USB.D+
  Bottom 0.203: v50.29,37.29 50.29,35.46 45.41,30.58 44.4,30.58 v43.79,29.97 | v39.83,29.97 17.37,29.97 v11.38,35.97
D-  (via drill 0.3)
  Top 0.203: v49.68,35.76 52.32,38.41 52.32,38.61 IC3.6
  Bottom 0.203: v49.68,35.76 48.67,35.76 28.55,15.65 19.41,15.65 18.49,14.73 17.78,14.73 13.11,19.41 13.11,28.85 6.81,35.15 6.81,36.17 7.62,36.98 8.84,36.98 9.96,38.1 USB.D-
GND  (via drill 0.3)
  Top 0.305: v64.01,54.97 64.01,55.98 Q1.2 | ISP.6 68.58,52.83 68.99,53.24 68.99,55.98 CAP.2 69.09,56.08 70.61,57.61 72.34,57.61 ENC28J60.2 72.44,57.71 72.44,58.12 73.86,59.54 | C9.2 62.08,44.09 63.91,45.92 63.91,46.74 66.24,49.07 66.45,49.07 67.36,49.99 67.36,50.9 68.48,52.02 68.48,52.63 ISP.6 | U1.P$1 65.33,76.5 66.14,75.69 66.14,67.06 U1.GND3 66.24,67.67 75.79,67.67 76.2,67.26 U1.6 | U1.6 76.3,66.55 76.3,67.16 76.81,67.67 80.06,67.67 80.47,67.26 80.67,67.26 U1.GND1 80.16,67.77 80.67,68.28 80.67,76.5 U1.P$2 | 73.86,59.54 76.2,61.87 76.2,66.34 U1.6 | RJ45.Y- 98.96,29.46 RJ45.G- 98.86,21.34 93.37,15.85 | EXTOUT.5 95.3,12.29 95.3,14.73 EXTOUT.7 95.2,14.94 94.28,14.94 93.37,15.85 | 93.37,15.85 91.75,17.48 91.14,17.48 RJ45.SHIELD1 | 87.78,57.1 89.92,57.1 C8.1 90.02,57.2 90.93,58.12 92.66,58.12 92.96,57.81 94.59,57.81 | 87.78,57.1 85.34,57.1 84.33,56.08 84.02,56.08 CX3.2 83.92,56.19 77.22,56.19 73.86,59.54 | 94.59,57.81 96.93,57.81 97.33,58.22 98.75,58.22 B2.2 | 94.59,57.81 94.59,63.3 98.75,67.46 98.75,68.38 B1.2 | RJ45.SHIELD0 91.03,33.43 87.58,29.97 85.24,29.97 RJ45.GND 85.04,29.97 80.26,34.75 80.06,34.75 ENC28J60.18 80.37,34.85 80.37,35.56 81.69,36.88 81.69,42.06 | 81.69,42.06 80.37,42.06 80.06,42.37 ENC28J60.21 80.06,42.47 80.06,44.91 ENC28J60.22 | 81.69,42.06 83.92,42.06 CX4.2 84.12,41.96 85.24,40.84 86.77,40.84 89.92,43.99 C7.1 89.81,44.09 89,44.91 89,47.95 89.2,48.16 | 89.2,48.16 92.76,48.16 93.27,47.65 96.93,47.65 97.33,48.06 98.75,48.06 B3.2 | 87.78,57.1 87.78,49.58 89.2,48.16 | C6.2 26.01,54.05 C4.2 26.11,53.95 27.13,52.93 29.46,52.93 34.14,48.26 34.54,48.26 ATMEGA.11
  Top 0.305: C5.2 24.08,57 25.91,57 C6.2 | CX2.2 43.99,53.03 42.06,53.03 CX1.2 42.06,53.14 42.06,57.2 37.59,61.67 | 37.59,61.67 33.83,61.67 32.11,63.4 ATMEGA.31 | ATMEGA.31 32,63.5 28.25,67.26 LCD.5 28.04,67.36 26.42,68.99 20.12,68.99 18.49,67.36 18.09,67.36 LCD.1 | 32.11,63.5 ATMEGA.31 | 37.59,61.67 38.2,62.28 38.2,64.01 39.42,65.23 39.42,67.97 40.84,69.39 40.84,72.14 U$1.19 | C6.2 26.11,57.1 32.21,63.2 ATMEGA.31 | RV.2 29.97,17.88 29.16,17.07 29.16,16.97 28.85,16.66 21.84,16.66 19.51,19 19.51,22.15 19.3,22.35 19.2,22.5 | 43.13,39.67 43.89,40.44 C13.1 44.09,40.44 45.82,38.71 46.02,38.71 IC3.1 46.13,38.61 46.13,37.9 48.97,35.05 52.63,35.05 53.44,35.87 53.44,36.47 X.2 53.54,35.76 57.71,31.6 62.89,31.6 S1.2 S1.1 63.09,25.4 63.09,24.28 | 43.13,39.67 39.52,36.07 39.01,36.07 C10.2 38.91,35.87 35.76,32.72 21.64,32.72 21.4,32.6 | 43.13,39.67 v41.55,41.25 | 9.45,34.44 8.33,35.56 8.03,35.56 USB.GND | 9.45,34.44 12.5,34.44 17.98,39.93 IC1.6 | C12.2 13.92,26.92 13.92,20.12 12.09,18.29 C1.- 11.89,18.19 7.72,18.19 5.49,15.95 | 7.21,10.16 7.21,13.92 C11.2 7.32,14.12 5.49,15.95 | 7.21,10.16 6.6,9.55 V0.2 | 7.21,10.16 8.64,8.74 11.99,8.74 C2.- | 5.49,15.95 3.35,18.09 3.35,20.02 POWER.1 3.35,20.22 3.35,26.01 9.35,32 9.35,34.34 9.45,34.44 | 68.48,39.52 IC4.4 68.58,39.62 68.78,39.62 70.31,41.15 73.15,41.15 73.25,41.05 | 73.25,41.05 74.07,40.23 74.07,36.47 72.44,34.85 ENC28J60.11 72.34,34.75 69.6,32 69.6,28.55 RBS.2 69.39,28.35 66.95,25.91 66.95,24.59 66.65,24.28 63.09,24.28 | RAIN.1 82.5,3.96 82.5,11.48 81.79,12.19 V9.2 81.69,12.39 76.1,17.98 P4.3 75.89,17.98 73.97,16.05 69.6,16.05 67.87,17.78 V8.1
  Top 0.305: IC5.8 47.55,25.4 47.55,24.79 48.56,23.77 54.15,23.77 54.97,22.96 54.97,21.13 58.22,17.88 58.73,17.88 V6.1 | 63.09,24.28 63.09,18.49 63.7,17.88 V7.1 | 73.25,41.05 74.68,42.47 74.68,49.78 73.36,51.1 71.63,51.1 69.6,53.14 69.09,53.14 ISP.6
  Top 0.406: D3.A 19.8,26.5 19.2,25.9 19.2,22.5 18.4,22.5 IC2.1
  Top 0.508: D3.A 21.6,26.5 21.6,29.7 21.4,29.9 IC1.5 21.4,31.4 21.4,32.6 20.8,33.2 18.6,33.2 18,32.6 IC1.3
  Bottom 0.305: v64.01,54.97 66.34,54.97 68.48,52.83 ISP.6 | RJ45.Y- 98.86,29.57 95,33.43 91.14,33.43 RJ45.SHIELD0 | LCD.1 17.98,67.36 17.98,70.61 16.87,71.73 16.87,73.56 17.98,74.68 U$1.2 | v41.55,41.25 34.65,48.16 ATMEGA.11 | C1.- 12.09,18.19 16.46,13.82 18.09,13.82 C3.- 18.19,13.92 22.55,13.92 23.77,15.14 27.23,15.14 31.39,10.97 T1.1 | BAT1.P$1 58.83,42.37 64.82,42.37 72.34,34.85 ENC28J60.11 | V8.1 67.77,17.78 63.91,17.78 V7.1 | 33.63,10.9 33.63,17.68 V1.1
  Bottom 0.406: T1.1 31.5,10.8 31.6,10.9 33.63,10.9 34,10.9 34.1,10.8 36.5,10.8 T2.1 36.6,10.9 39,10.9 39.1,10.8 41.5,10.8 T3.1 41.6,10.9 44,10.9 44.1,10.8 46.5,10.8 T4.1 46.6,10.9 49,10.9 49.1,10.8 51.5,10.8 T5.1 51.6,10.9 54,10.9 54.1,10.8 56.5,10.8 T6.1 56.6,10.9 59,10.9 59.1,10.8 61.5,10.8 T7.1 61.6,10.9 64,10.9 64.1,10.8 66.5,10.8 T8.1 | V1.1 38.7,17.8 V2.1 38.9,17.8 43.7,17.8 V3.1 43.9,17.8 48.7,17.8 V4.1 48.9,17.8 53.7,17.8 V5.1 53.9,17.8 58.7,17.8 V6.1 58.9,17.8 63.7,17.8 V7.1
  pour Top (isolate 0.254): 6,47 71,47 71,23 6,23
INT0  (via drill 0.3)
  Top 0.203: v55.37,61.57 v55.37,52.63
  Bottom 0.203: v55.37,52.63 52.22,52.63 47.85,48.26 47.35,48.26 ATMEGA.16 | v55.37,61.57 55.37,61.77 55.98,62.38 55.98,64.52 54.86,65.63 53.14,65.63 52.43,66.34 52.43,68.58 50.39,70.61 30.68,70.61 29.57,71.73 29.57,73.56 30.68,74.68 U$1.12
INT1  (via drill 0.3)
  Top 0.203: v74.27,23.37 77.11,20.52 77.11,18.59 84.63,11.07 87.48,11.07 RZ.2
  Bottom 0.203: v74.27,23.37 74.07,23.37 67.56,29.87 67.56,32.92 67.26,33.22 64.72,33.22 58.01,39.93 57.4,39.93 49.89,47.45 49.89,48.16 ATMEGA.17
INT2
  Top 0.203: ATMEGA.3 14.33,48.26 14.33,61.37 15.44,62.48 15.44,74.98 16.97,76.5 31.5,76.5 33.22,74.78 U$1.14
LEDA
  Top 0.203: REA.2 89.51,13.92 92.25,11.18 95.71,11.18 98.86,14.33 98.86,18.8 RJ45.G+
LEDB
  Top 0.203: REB.2 85.55,14.02 85.55,15.75 97.84,28.04 97.84,30.99 98.86,32 RJ45.Y+
MISO  (via drill 0.3)
  Top 0.203: v77.32,57.1 77.32,66.45 U1.7 | v56.79,70.31 v54.25,70.31
  Bottom 0.203: ATMEGA.7 24.49,48.26 24.99,48.26 29.97,53.24 60.45,53.24 63.4,50.29 ISP.1 63.5,50.19 63.5,46.02 70.71,38.81 73.46,38.81 73.51,38.86 | 73.51,38.86 74.07,39.42 74.07,45.82 72.44,47.45 ENC28J60.6 | 73.51,38.86 74.07,38.3 74.07,36.88 73.97,36.78 73.97,35.66 74.27,35.36 74.88,35.36 77.32,37.8 v77.32,57.1 77.32,57.3 73.56,61.06 73.56,64.62 67.87,70.31 v56.79,70.31 | v54.25,70.31 53.14,71.42 43.59,71.42 41.55,73.46 38,73.46 36.78,72.24 35.87,72.24 U$1.15
MOSI  (via drill 0.3)
  Top 0.203: v72.95,64.31 72.95,66.45 U1.3 | ENC28J60.7 72.34,45.01 70.71,46.63 v70.71,50.7 69.8,51.61 v69.49,51.61 | ATMEGA.6 21.84,48.26 21.44,48.26 19.81,49.89 16.46,49.89 15.34,48.77 15.34,47.14 14.73,46.53 13.92,46.53 13.31,47.14 13.31,73.46 16.76,76.91 33.63,76.91 35.76,74.78 U$1.16 35.87,74.78 v38.3,77.22
  Bottom 0.203: v72.95,64.31 72.95,62.79 70.76,60.6 | 70.76,60.6 70.71,60.55 v70.71,50.7 | v69.49,51.61 68.17,51.61 67.06,52.73 66.04,52.73 ISP.4 | v38.3,77.22 40.13,77.22 45.11,72.24 53.85,72.24 60.96,65.13 64.31,65.13 68.78,60.66 70.71,60.66 70.76,60.6
N$1
  Top 0.508: IC1.1 14.6,29.9 14.5,29.8 13.6,29.8 12,28.2 C12.1 12,24.5 | 12,24.5 C1.+ | 12,24.5 6.1,24.5 6,24.6 6,26 D1.C
N$2
  Top 0.305: 9.86,14.43 11.99,12.29 C2.+ | 9.86,14.43 8.33,15.95 7.32,15.95 C11.1 | 14.43,19 14.43,20.22 18.39,24.18 18.39,25.91 19.61,27.13 19.61,31.19 IC1.4 | 9.86,14.43 14.43,19 | 26.62,27.12 30.99,22.76 30.99,18.9 31.09,18.8 31.09,16.97 30.28,16.15 19.2,16.15 16.46,18.9 14.53,18.9 14.43,19
  Top 0.406: L1.2 29.6,30.1 26.62,27.12 24,24.5 24,22.5 F1.1
N$3
  Top 0.203: R1.1 33.93,21.95 33.93,19.3 32.82,18.19 32.82,10.06 33.33,9.55 T1.2
N$4
  Top 0.203: R6.2 52.02,22.05 51.82,22.05 50.6,23.27 47.14,23.27 46.33,24.08 44.5,24.08 43.79,24.79 43.79,25.4 IC5.5
N$5
  Top 0.203: R7.2 55.98,22.05 55.98,22.66 54.36,24.28 48.77,24.28 48.26,24.79 48.26,26.52 47.95,26.82 45.82,26.82 45.01,26.01 45.01,25.5 IC5.6
N$6
  Bottom 0.305: J2.2 1.93,56.29 1.93,54.86 3.96,52.83 3.96,49.28 1.83,47.14 1.83,17.58 3.25,16.15 POWER.2
N$7  (via drill 0.3)
  Top 0.203: v49.07,24.89 56.9,24.89 59.74,22.05 60.05,22.05 R8.2 | v47.45,23.88 47.24,23.88 46.33,24.79 46.33,25.4 IC5.7
  Bottom 0.203: v49.07,24.89 48.46,24.89 v47.45,23.88
N$8  (via drill 0.3)
  Top 0.203: v66.95,32.61 68.58,34.24 68.58,37.39 67.16,38.81 67.16,39.42 IC4.3
  Bottom 0.203: v66.95,32.61 65.02,32.61 58.83,26.42 BAT1.P$2
N$9
  Top 0.406: L1.1 29.8,39.9 23.8,33.9 18.3,33.9 17.5,33.1 16.9,33.1 16.3,32.5 16.3,31.4 IC1.2
  Top 0.508: D3.C 16.3,26.5 IC1.2
N$10
  Top 0.203: R5.2 47.95,22.05 47.75,22.05 46.13,23.67 43.69,23.67 42.47,24.89 42.47,25.4 IC5.4
N$11
  Top 0.203: R4.2 43.99,22.05 41.25,24.79 41.25,25.4 IC5.3
N$12
  Top 0.203: R3.2 40.03,22.05 40.03,25.3 39.93,25.4 IC5.2
N$13
  Top 0.203: R2.2 36.07,22.05 36.07,22.86 38.61,25.4 IC5.1
N$14
  Top 0.203: R1.2 32.11,22.05 32.11,23.16 39.83,30.89 39.83,31.5 IC5.15
N$15
  Top 0.203: R2.1 37.9,21.95 37.9,18.29 37.8,18.19 37.8,10.16 38.41,9.55 T2.2
N$16
  Top 0.406: S12.1 32.2,3.9 32.2,7.5 31.5,8.2 T1.3 31.3,8.3 30.9,8.3 29.9,9.3 29.9,12.3 30.2,12.6 V1.2
N$17
  Top 0.406: S12.2 37.3,3.9 37.3,7.4 36.5,8.2 T2.3 36.4,8.4 36.4,8.9 34.9,10.4 34.9,12.3 35.2,12.6 V2.2
N$18
  Top 0.406: S34.1 42.4,3.9 42.4,7.3 41.5,8.2 T3.3 41.4,8.4 41.4,8.9 39.9,10.4 39.9,12.3 40.2,12.6 V3.2
N$19
  Top 0.203: RBS.1 69.6,26.62 71.83,26.62 72.34,27.13 ENC28J60.14
N$20
  Top 0.406: S34.2 47.5,7.2 46.5,8.2 T4.3 46.4,8.4 46.4,8.9 44.9,10.4 44.9,12.3 45.2,12.6 V4.2
N$21
  Top 0.203: R3.1 41.96,21.95 41.96,12.09 43.38,10.67 43.38,9.55 T3.2
N$22
  Top 0.406: S56.1 52.5,3.9 52.5,7.2 51.5,8.2 T5.3 51.4,8.4 51.4,8.9 49.9,10.4 49.9,12.3 50.2,12.6 V5.2
N$23
  Top 0.406: S56.2 57.6,3.9 57.6,7.1 56.5,8.2 T6.3 56.4,8.4 56.4,8.9 54.9,10.4 54.9,12.3 55.2,12.6 V6.2
N$24
  Top 0.406: S78.1 62.7,3.9 62.7,7 61.5,8.2 T7.3 61.4,8.4 61.4,8.9 59.9,10.4 59.9,12.3 60.2,12.6 V7.2
N$25
  Top 0.406: S78.2 67.8,3.9 67.8,6.9 66.5,8.2 T8.3 66.4,8.4 66.4,8.8 64.3,10.9 64.3,14.2 V8.2
N$26
  Top 0.203: R4.1 46.02,21.95 46.02,14.83 48.36,12.5 48.36,9.55 T4.2
N$27
  Top 0.203: R5.1 49.99,21.95 49.99,15.85 53.34,12.5 53.34,9.55 T5.2
N$28
  Top 0.203: R6.1 54.05,21.95 54.05,19 58.32,14.73 58.32,9.55 T6.2
N$29
  Top 0.203: R7.1 58.01,21.95 58.01,20.02 63.2,14.83 63.2,9.75 63.4,9.55 T7.2
N$30
  Top 0.203: IC4.1 64.62,39.42 64.62,38.81 66.65,36.78 67.16,36.78 X2.2
N$31
  Top 0.203: 87.22,8.79 87.17,8.74 85.34,8.74 V9.1 | 87.22,8.79 89.41,10.97 RZ.1 | 87.22,8.79 87.58,8.43 87.58,3.96 RAIN.2
N$32
  Bottom 0.305: F0.1 5.99,5.08 5.99,8.53 4.67,9.86 4.67,22.35 2.74,24.28 2.74,47.24 4.47,48.97 4.47,55.37 2.34,57.51 1.52,57.51 0.81,56.79 0.81,54.36 1.83,53.34 J2.3
N$33
  Top 0.203: CAP.1 69.09,58.01 70.21,58.01 72.34,60.15 ENC28J60.1
N$34  (via drill 0.3)
  Top 0.203: v87.58,16.87 87.58,14.02 REA.1 | v86.26,31.09 84.23,33.12 v84.23,40.74
  Bottom 0.203: v87.58,16.87 87.58,19.1 86.26,20.42 v86.26,31.09 | v84.23,40.74 84.23,45.92 81.69,48.46 81.69,55.98 80.06,57.61 ENC28J60.27
N$35
  Top 0.203: Q1.3 62.99,58.12 62.99,60.45 61.98,61.47 DF.A 61.87,61.57 57.4,66.04 57.4,73.46 RELAY.9
N$36
  Top 0.203: IC4.2 65.94,39.42 65.94,38.81 66.95,37.8 67.56,37.8 68.17,37.19 68.17,35.15 67.26,34.24 X2.1
N$37
  Top 0.203: REB.1 83.52,14.02 83.52,15.14 76.2,22.45 76.2,51.31 79.96,55.07 ENC28J60.26
N$39
  Top 0.406: D2.A 26.1,19.1 26.2,19.2 28.1,19.2 28.2,19.1 28.2,17.9 RV.1
N$40
  Top 0.203: Q1.1 62.08,56.08 62.69,56.08 64.52,57.91 65.94,57.91 RQ.1
N$41
  Top 0.203: CX3.1 85.95,55.98 85.95,52.43 85.04,51.51 X1.2 84.94,51.41 83.62,50.09 80.06,50.09 ENC28J60.24
N$42
  Top 0.203: CX4.1 85.95,42.06 85.95,45.62 85.04,46.53 X1.1 84.94,46.63 84.12,47.45 80.06,47.45 ENC28J60.23
N$43
  Top 0.203: R8.1 61.98,21.95 61.98,17.88 68.38,11.48 68.38,9.55 T8.2
N$44
  Top 0.203: IC3.7 53.65,38.61 53.65,38.3 52.32,36.98 52.32,36.58 X.1
N$46
  Top 0.203: X0.2 40.95,56.79 40.03,55.88 40.03,53.03 CX1.1 39.93,52.93 37.19,50.19 37.19,48.26 ATMEGA.12
N$47
  Top 0.203: X0.1 45.82,56.79 45.92,56.69 45.92,53.03 CX2.1 45.82,53.03 44.7,51.92 43.89,51.92 40.23,48.26 39.73,48.26 ATMEGA.13
N$48
  Top 0.203: IC3.8 54.86,38.61 54.86,36.68 54.76,36.58 X.3
N$54
  Top 0.203: RR-.2 92.05,46.94 92.05,44.09 C7.2 91.95,43.99 91.95,41.05 RR+.1
NC
  Top 0.508: RELAY.1 59.94,81.08 84.43,81.08 84.94,80.57 JC.1
NO
  Bottom 0.508: RELAY.10 59.94,73.46 84.02,73.46 84.94,72.54 JO.1
QH*  (via drill 0.3)
  Top 0.203: v48.97,31.5 47.55,31.5 IC5.9
  Bottom 0.203: v48.97,31.5 59.33,21.13 78.74,21.13 92.66,7.21 EXTOUT.2
RD+  (via drill 0.3)
  Top 0.203: 88.8,23.67 87.68,23.67 RJ45.RD+ | 88.8,23.67 90.12,23.67 96.62,30.18 96.62,32.31 90.12,38.81 90.12,40.95 RR+.2 | v79.96,22.15 83.72,22.15 85.95,19.91 88.49,19.91 88.8,20.22 88.8,23.67
  Bottom 0.203: v79.96,22.15 72.44,29.67 ENC28J60.13
RD-  (via drill 0.3)
  Top 0.203: RR-.1 90.12,46.94 90.12,45.62 90.93,44.81 90.93,43.18 89.81,42.06 89.2,42.06 89,41.86 89,39.32 96.22,32.11 96.22,30.38 93.27,27.43 85.14,27.43 RJ45.RD- 85.14,27.53 84.02,28.65 84.02,30.28 81.08,33.22 78.94,33.22 78.03,32.31 v77.32,32.31
  Bottom 0.203: v77.32,32.31 72.44,32.31 ENC28J60.12
RESET  (via drill 0.3)
  Top 0.203: RR.2 23.77,54.05 23.77,53.85 29.46,48.16 ATMEGA.9 29.57,48.16 30.99,46.74 30.99,45.01 C14.2 31.09,44.91 31.09,44.6 32.31,43.38 45.92,43.38 47.65,41.66 53.85,41.66 62.89,32.61 64.92,32.61 65.94,31.6 S1.4 | S1.3 66.04,25.5 66.04,31.5 S1.4 | S1.4 66.14,31.5 66.75,31.5 72.34,37.08 72.34,37.29 ENC28J60.10 72.34,37.39 70.61,39.12 v70.61,40.44 | v67.16,47.14 67.16,47.85 68.48,49.17 68.48,50.19 ISP.5
  Bottom 0.203: v67.16,47.14 67.16,43.89 v70.61,40.44
RTS
  Top 0.203: IC3.14 48.56,44.4 47.75,45.21 33.22,45.21 33.02,45.01 C14.1
RXD  (via drill 0.3)
  Top 0.203: v42.27,42.47 43.18,41.55 44.7,41.55 47.24,39.01 47.24,38.71 IC3.2 | U$1.10 28.25,74.68 29.16,74.68 30.38,73.46 33.73,73.46 34.65,72.54 34.65,71.73 35.36,71.02 36.27,71.02 37.19,71.93 37.19,72.64 38,73.46 44.09,73.46 48.56,68.99 48.87,68.99 49.48,68.38 49.48,65.13 48.36,64.01 48.36,59.74 47.35,58.73 47.35,51.71 45.52,49.89 43.89,49.89 42.27,48.26 ATMEGA.14
  Bottom 0.203: v42.27,42.47 42.27,48.16 ATMEGA.14
SCK  (via drill 0.3)
  Top 0.203: U1.5 75.08,66.45 75.08,61.67 74.47,61.06 73.56,61.06 73.46,61.16 70.41,61.16 67.67,58.42 67.67,53.44 67.16,52.93 67.16,51.41 66.04,50.29 ISP.3 | ATMEGA.8 26.92,48.26 26.52,48.26 21.84,52.93 20.22,52.93 15.85,57.3 15.85,67.87 19,71.02 21.03,71.02 21.95,71.93 21.95,75.18 22.76,76 26.11,76 27.03,75.08 27.03,74.27 27.84,73.46 28.65,73.46 29.57,72.54 29.57,71.73 30.28,71.02 32.11,71.02 33.22,72.14 U$1.13 | v49.17,51 50.9,49.28 50.9,47.04 51.82,46.13 51.92,46.13 53.03,45.01 53.03,43.59 53.24,43.38 55.17,43.38 56.49,42.06 64.82,42.06 65.13,42.37 72.34,42.37 ENC28J60.8
  Bottom 0.203: ENC28J60.8 72.34,42.47 72.34,42.88 66.04,49.17 66.04,50.19 ISP.3 | v49.17,51 47.85,51 46.63,52.22 30.99,52.22 27.03,48.26 ATMEGA.8
SCL  (via drill 0.3)
  Top 0.203: ATMEGA.22 54.86,63.4 54.05,62.59 54.05,57.1 RCL.2 54.05,57 54.97,56.08 54.97,53.14 52.68,50.85 | 52.68,50.85 51.41,49.58 51.41,47.14 52.02,46.53 54.05,46.53 58.12,42.47 64.62,42.47 67.06,44.91 67.06,45.52 IC4.6 | v19.2,75.89 19.3,75.79 19.3,74.37 20.52,73.15 20.52,72.24 U$1.3 | v45.62,72.85 49.99,68.48 49.99,65.43 50.9,64.52 50.9,60.86 50.6,60.55 50.6,52.93 52.68,50.85
  Bottom 0.203: v19.2,75.89 19.51,75.89 21.44,77.83 40.64,77.83 v45.62,72.85
SDA  (via drill 0.3)
  Top 0.203: RDA.2 53.95,53.95 52.93,52.93 51.21,52.93 51,53.14 51,60.35 52.32,61.67 52.32,63.4 ATMEGA.23 52.32,63.5 52.32,70.21 48.26,74.27 v48.26,75.89 | v70,50.09 68.48,48.56 68.48,45.62 IC4.5 | v16.66,74.47 17.98,73.15 17.98,72.24 U$1.1
  Bottom 0.203: v70,50.09 70,51.21 70.1,51.31 70.1,52.73 61.87,60.96 54.86,60.96 52.43,63.4 ATMEGA.23 | v16.66,74.47 16.66,74.98 19.91,78.23 40.84,78.23 43.18,75.89 v48.26,75.89
TCT  (via drill 0.3)
  Top 0.203: 92.05,55.07 92.05,54.05 RT+.1 | 92.05,55.07 92.05,57 C8.2 92.15,57 v93.07,57 | L2.1 85.95,60.05 88.19,60.05 89.2,61.06 90.93,61.06 91.95,60.05 RT-.2 92.05,59.94 v93.07,58.93 | v88.49,54.36 89.2,55.07 92.05,55.07
  Bottom 0.203: v93.07,58.93 v93.07,57 | v88.49,54.36 87.88,53.75 87.88,43.08 81.08,36.27 79.45,36.27 78.33,35.15 78.33,29.26 78.94,28.65 80.57,28.65 84.33,24.89 85.04,24.89 RJ45.P4
TD+  (via drill 0.3)
  Top 0.203: v88.49,52.43 90.02,53.95 RT+.2 | RJ45.TD+ 87.58,21.13 87.58,21.44 85.24,23.77 84.63,23.77 82.09,26.31 82.09,30.18 80.06,32.21 ENC28J60.17
  Bottom 0.203: v88.49,52.43 88.49,40.74 80.06,32.31 ENC28J60.17
TD-  (via drill 0.3)
  Top 0.203: v89.1,58.12 90.02,59.03 90.02,59.94 RT-.1 | RJ45.TD- 85.04,22.35 85.04,22.76 81.69,26.11 81.69,28.04 80.06,29.67 ENC28J60.16
  Bottom 0.203: v89.1,58.12 89.1,40.74 81.69,33.33 81.69,31.39 80.06,29.77 ENC28J60.16
TXD  (via drill 0.3)
  Top 0.203: v48.56,40.44 48.56,38.71 IC3.3 | v46.94,46.02 44.81,48.16 ATMEGA.15 44.7,48.16 43.08,46.53 36.78,46.53 36.17,47.14 36.17,49.38 30.58,54.97 v30.58,57.3
  Bottom 0.203: v48.56,40.44 48.56,44.4 v46.94,46.02 | v30.58,57.3 30.58,64.52 29.67,65.43 29.67,69.7 28.25,71.12 28.25,72.14 U$1.9
VCC  (via drill 0.3)
  Top 0.203: U1.4 73.97,66.45 73.97,63.09 RSD.2 73.97,62.99 73.97,61.87 v74.17,61.67 | L2.2 84.02,60.05 80.16,60.05 80.06,60.15 ENC28J60.28 | 34.7,68.53 38.3,72.14 U$1.17 | 34.7,68.53 34.65,68.48 34.65,63.5 ATMEGA.30 | 25.25,73.51 25.3,73.46 26.11,73.46 27.03,72.54 27.03,71.73 29.77,68.99 34.24,68.99 34.7,68.53 | 25.25,73.51 24.08,74.68 23.16,74.68 U$1.6 | C6.1 28.04,57 28.04,54.05 C4.1 28.14,54.05 30.89,54.05 35.66,49.28 35.66,47.14 35.05,46.53 32.11,46.53 | 32.11,46.53 32.11,48.16 ATMEGA.10 32,48.26 30.38,49.89 28.35,49.89 25.09,53.14 25.09,54.66 24.59,55.17 22.96,55.17 21.95,54.15 RR.1 21.84,54.15 20.93,54.15 18.09,57 RPR.2 17.98,57.1 17.98,64.41 16.97,65.43 16.97,68.38 18.09,69.49 22.05,69.49 24.38,71.83 24.38,72.64 25.25,73.51 | 32.11,46.53 32.11,44.2 32.31,43.99 33.73,43.99 34.04,44.3 46.02,44.3 IC3.16 46.02,44.2 v47.95,42.27 55.68,42.27 62.38,35.56 v67.26,35.56 | C13.2 44.09,42.47 44.4,42.47 45.62,41.25 48.67,41.25 49.78,40.13 49.78,38.71 IC3.4 49.78,38.61 49.78,37.69 v48.56,36.47 | v18.39,17.98 18.39,20.52 IC2.2 | IC5.10 46.23,31.6 46.23,32.72 43.08,35.87 42.57,35.87 ROE.2 42.47,35.87 40.84,35.87 39.01,34.04 C10.1 38.91,33.93 38.91,31.8 38.71,31.6 IC5.16 38.61,31.5 v36.47,29.36
  Bottom 0.203: 78.38,58.57 79.96,60.15 ENC28J60.28 | 78.38,58.57 78.33,58.52 78.33,54.66 79.96,53.03 79.96,52.63 ENC28J60.25 79.96,52.43 79.96,52.02 78.33,50.39 78.33,41.55 79.96,39.93 ENC28J60.20 79.96,39.83 79.96,37.49 ENC28J60.19 79.96,37.39 77.93,35.36 77.93,33.73 | v74.17,61.67 75.29,61.67 78.38,58.57 | 77.93,33.73 77.93,29.06 79.76,27.23 79.96,27.23 ENC28J60.15 79.96,27.03 79.96,23.47 92.25,11.18 92.86,11.18 93.88,10.16 93.88,9.55 95.2,8.23 95.2,7.21 EXTOUT.1 | C3.+ 18.19,15.85 18.39,16.05 v18.39,17.98 25.09,17.98 v36.47,29.36 41.66,29.36 48.56,36.27 v48.56,36.47 47.95,37.08 v47.95,42.27 | 77.93,33.73 69.09,33.73 v67.26,35.56
VIN  (via drill 0.3)
  Top 0.305: v20.52,24.79 20.52,21.64 IC2.3 | RDA.1 52.02,54.05 52.02,57 RCL.1 52.12,57.1 52.12,60.76 53.54,62.18 53.54,67.26 LCD.15 53.54,67.46 53.54,71.32 57.3,75.08 | IC4.8 64.52,45.52 64.52,44.6 62.89,42.98 61.16,42.98 60.86,43.28 60.86,44.91 61.87,45.92 C9.1 62.08,46.02 62.08,51.41 63.4,52.73 ISP.2 63.6,52.73 64.82,53.95 65.84,53.95 67.16,55.27 67.16,58.73 66.04,59.84 66.04,61.47 DF.C 65.94,61.57 58.52,68.99 58.52,73.97 57.81,74.68 57.71,74.68 57.3,75.08 | v74.57,35.97 74.57,27.23 73.56,26.21 73.56,18.09 P4.2 | 57.3,75.08 57.3,81.08 RELAY.2 57.2,81.18 49.07,81.18 47.75,82.5 46.63,82.5 38.91,74.78 38.41,74.78 U$1.18
  Top 0.406: 22.7,19.9 22.7,20 22.1,20.6 22.1,21.4 22,21.5 IC2.3 | 22.7,19.9 D2.C | 22.7,19.9 26.8,19.9 28,21.1 28,22.5 F1.2
  Bottom 0.305: v20.52,24.79 20.52,25.2 10.16,35.56 USB.VBUS 10.06,35.66 10.06,36.47 18.29,44.7 18.29,60.15 20.52,62.38 20.52,67.16 LCD.2 20.62,67.36 20.62,70.51 21.84,71.73 21.84,73.46 20.62,74.68 U$1.4 21.03,74.47 22.55,76 37.08,76 38.3,74.78 U$1.18 | v74.57,35.97 74.57,47.35 72.95,48.97 68.17,48.97 67.16,49.99 67.16,50.7 66.24,51.61 64.62,51.61 63.5,52.73 ISP.2

### Text on the board
tNames: OpenSprinkler DIY v2.2u | NC | http://www.opensprinkler.com | GND VIN VCC A6 RXD INT0 INT2 MSI VIN | CO | NO | (Rev. 08/20) | SDA SCL A5 A7 TXD D15 SCK MISO VCC GND | ISP | RESET | POWER | A3 VIN GND | RF | COM | EXTOUT | S1-8 | Rain
BoxDim: Serpac WM-032C Enclosure | All units are in inch | Left | Right | Front | Bottom